# Altium schematic sheet BMC-01A.SchDoc
size A4
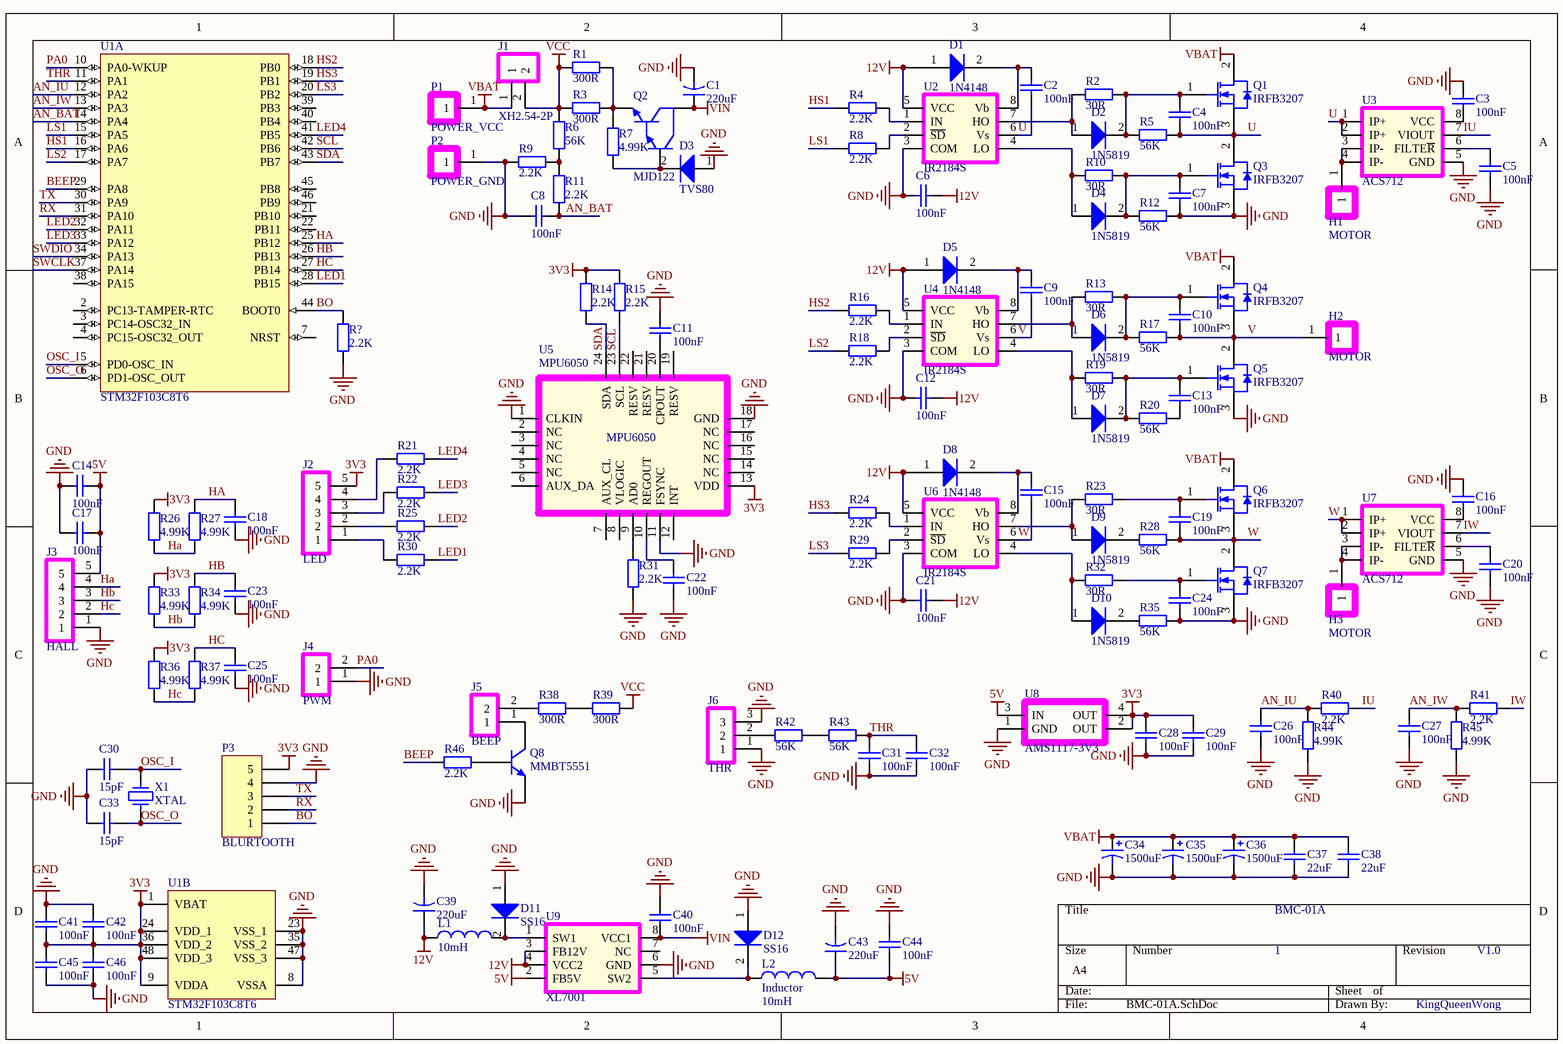
[diagram p0: BMC-01A.SchDoc]

## Parts
C1  value 220uF  [CAPR5-4X5]  (hidden comment: Cap2)
C2  value 100nF  [0603C]  (hidden comment: Cap)
C3  value 100nF  [0603C]  (hidden comment: Cap)
C4  value 100nF  [0603C]  (hidden comment: Cap)
C5  value 100nF  [0603C]  (hidden comment: Cap)
C6  value 100nF  [0603C]  (hidden comment: Cap)
C7  value 100nF  [0603C]  (hidden comment: Cap)
C8  value 100nF  [0603C]  (hidden comment: Cap)
C9  value 100nF  [0603C]  (hidden comment: Cap)
C10  value 100nF  [0603C]  (hidden comment: Cap)
C11  value 100nF  [0603C]  (hidden comment: Cap)
C12  value 100nF  [0603C]  (hidden comment: Cap)
C13  value 100nF  [0603C]  (hidden comment: Cap)
C14  value 100nF  [0603C]  (hidden comment: Cap)
C15  value 100nF  [0603C]  (hidden comment: Cap)
C16  value 100nF  [0603C]  (hidden comment: Cap)
C17  value 100nF  [0603C]  (hidden comment: Cap)
C18  value 100nF  [0603C]  (hidden comment: Cap)
C19  value 100nF  [0603C]  (hidden comment: Cap)
C20  value 100nF  [0603C]  (hidden comment: Cap)
C21  value 100nF  [0603C]  (hidden comment: Cap)
C22  value 100nF  [0603C]  (hidden comment: Cap)
C23  value 100nF  [0603C]  (hidden comment: Cap)
C24  value 100nF  [0603C]  (hidden comment: Cap)
C25  value 100nF  [0603C]  (hidden comment: Cap)
C26  value 100nF  [0603C]  (hidden comment: Cap)
C27  value 100nF  [0603C]  (hidden comment: Cap)
C28  value 100nF  [0603C]  (hidden comment: Cap)
C29  value 100nF  [0603C]  (hidden comment: Cap)
C30  value 15pF  [0603C]  (hidden comment: Cap)
C31  value 100nF  [0603C]  (hidden comment: Cap)
C32  value 100nF  [0603C]  (hidden comment: Cap)
C33  value 15pF  [0603C]  (hidden comment: Cap)
C34  value 1500uF  [RB7.6-15]  (hidden comment: Cap Pol1)
C35  value 1500uF  [RB7.6-15]  (hidden comment: Cap Pol1)
C36  value 1500uF  [RB7.6-15]  (hidden comment: Cap Pol1)
C37  value 22uF  [C1206]  (hidden comment: Cap)
C38  value 22uF  [C1206]  (hidden comment: Cap)
C39  value 220uF  [CAPR5-4X5]  (hidden comment: Cap2)
C40  value 100nF  [0603C]  (hidden comment: Cap)
C41  value 100nF  [0603C]  (hidden comment: Cap)
C42  value 100nF  [0603C]  (hidden comment: Cap)
C43  value 220uF  [CAPR5-4X5]  (hidden comment: Cap2)
C44  value 100nF  [0603C]  (hidden comment: Cap)
C45  value 100nF  [0603C]  (hidden comment: Cap)
C46  value 100nF  [0603C]  (hidden comment: Cap)
D1  1N4148  [SOD80C]
D2  1N5819  [SOD323]
D3  TVS80  [SMA]
D4  1N5819  [SOD323]
D5  1N4148  [SOD80C]
D6  1N5819  [SOD323]
D7  1N5819  [SOD323]
D8  1N4148  [SOD80C]
D9  1N5819  [SOD323]
D10  1N5819  [SOD323]
D11  SS16  [SMA]
D12  SS16  [SMA]
H1  MOTOR  [MOTOR]
H2  MOTOR  [MOTOR]
H3  MOTOR  [MOTOR]
J1  XH2.54-2P
J2  LED
J3  HALL
J4  PWM
J5  BEEP
J6  THR
L1  value 10mH  [CD43]  (hidden comment: Inductor)
L2  Inductor  value 10mH  [CD43]
P1  POWER_VCC  [POWER]
P2  POWER_GND  [POWER]
P3  BLURTOOTH  [HDR1X5]
Q1  IRFB3207  [TO220-3]
Q2  MJD122  [DPAK]
Q3  IRFB3207  [TO220-3]
Q4  IRFB3207  [TO220-3]
Q5  IRFB3207  [TO220-3]
Q6  IRFB3207  [TO220-3]
Q7  IRFB3207  [TO220-3]
Q8  MMBT5551  [SOT23]
R1  value 300R  [0603R]  (hidden comment: Res2)
R2  value 30R  [0603R]  (hidden comment: Res2)
R3  value 300R  [0603R]  (hidden comment: Res2)
R4  value 2.2K  [0603R]  (hidden comment: Res2)
R5  value 56K  [0603R]  (hidden comment: Res2)
R6  value 56K  [0603R]  (hidden comment: Res2)
R7  value 4.99K  [0603R]  (hidden comment: Res2)
R8  value 2.2K  [0603R]  (hidden comment: Res2)
R9  value 2.2K  [0603R]  (hidden comment: Res2)
R10  value 30R  [0603R]  (hidden comment: Res2)
R11  value 2.2K  [0603R]  (hidden comment: Res2)
R12  value 56K  [0603R]  (hidden comment: Res2)
R13  value 30R  [0603R]  (hidden comment: Res2)
R14  value 2.2K  [0603R]  (hidden comment: Res2)
R15  value 2.2K  [0603R]  (hidden comment: Res2)
R16  value 2.2K  [0603R]  (hidden comment: Res2)
R17  value 56K  [0603R]  (hidden comment: Res2)
R18  value 2.2K  [0603R]  (hidden comment: Res2)
R19  value 30R  [0603R]  (hidden comment: Res2)
R20  value 56K  [0603R]  (hidden comment: Res2)
R21  value 2.2K  [0603R]  (hidden comment: Res2)
R22  value 2.2K  [0603R]  (hidden comment: Res2)
R23  value 30R  [0603R]  (hidden comment: Res2)
R24  value 2.2K  [0603R]  (hidden comment: Res2)
R25  value 2.2K  [0603R]  (hidden comment: Res2)
R26  value 4.99K  [0603R]  (hidden comment: Res2)
R27  value 4.99K  [0603R]  (hidden comment: Res2)
R28  value 56K  [0603R]  (hidden comment: Res2)
R29  value 2.2K  [0603R]  (hidden comment: Res2)
R30  value 2.2K  [0603R]  (hidden comment: Res2)
R31  value 2.2K  [0603R]  (hidden comment: Res2)
R32  value 30R  [0603R]  (hidden comment: Res2)
R33  value 4.99K  [0603R]  (hidden comment: Res2)
R34  value 4.99K  [0603R]  (hidden comment: Res2)
R35  value 56K  [0603R]  (hidden comment: Res2)
R36  value 4.99K  [0603R]  (hidden comment: Res2)
R37  value 4.99K  [0603R]  (hidden comment: Res2)
R38  value 300R  [0603R]  (hidden comment: Res2)
R39  value 300R  [0603R]  (hidden comment: Res2)
R40  value 2.2K  [0603R]  (hidden comment: Res2)
R41  value 2.2K  [0603R]  (hidden comment: Res2)
R42  value 56K  [0603R]  (hidden comment: Res2)
R43  value 56K  [0603R]  (hidden comment: Res2)
R44  value 4.99K  [0603R]  (hidden comment: Res2)
R45  value 4.99K  [0603R]  (hidden comment: Res2)
R46  value 2.2K  [0603R]  (hidden comment: Res2)
R?  value 2.2K  [0603R]  (hidden comment: Res2)
U1  STM32F103C8T6  [STM-LQFP48_N]  (parts A,B of 2)
U2  IR2184S  [SOP8L]
U3  ACS712  [SOP8L]
U4  IR2184S  [SOP8L]
U5  MPU6050  [QFN24]
U6  IR2184S  [SOP8L]
U7  ACS712  [SOP8L]
U8  AMS1117-3V3  [SOT223]
U9  XL7001  [SOP8L]
X1  XTAL  [XTAL]

## Nets
3V3: C28.2 C29.2 C41.1 C42.1 C45.2 C46.2 J2.5 P3.5 R14.1 R15.1 R26.1 R33.1 R36.1 U1.1(VBAT) U1.9(VDDA) U1.24(VDD_1) U1.36(VDD_2) U1.48(VDD_3) U5.13(VDD) U8.2(OUT) U8.4(OUT)
5V: C14.2 C17.2 C43.1 C44.1 J3.5 L2.2 U8.3(IN) U9.2(FB5V)
12V: C6.2 C12.2 C21.2 C39.1 D1.1 D5.1 D8.1 L1.1 U2.5(VCC) U4.5(VCC) U6.5(VCC) U9.3(FB12V) U9.4(VCC2)
GND: C1.2 C3.1 C5.2 C6.1 C7.2 C8.2 C11.2 C12.1 C14.1 C16.1 C17.1 C18.1 C20.2 C21.1 C22.1 C23.1 C24.2 C25.1 C26.1 C27.1 C28.1 C29.1 C30.1 C31.1 C32.1 C33.2 C34.2 C35.2 C36.2 C37.1 C38.1 C39.2 C40.2 C41.2 C42.2 C43.2 C44.2 C45.1 C46.1 D3.1 D11.1 D12.1 J3.1 J4.1 J6.1 J6.3 P2.1 P3.4 Q3.3(SOURCE) Q5.3(SOURCE) Q7.3(SOURCE) Q8.3(E) R9.1 R12.1 R31.2 R35.1 R44.2 R45.2 R?.1 U1.8(VSSA) U1.23(VSS_1) U1.35(VSS_2) U1.47(VSS_3) U2.3(COM) U3.5(GND) U4.3(COM) U5.1(CLKIN) U5.11(FSYNC) U5.18(GND) U6.3(COM) U7.5(GND) U8.1(GND) U9.6(GND)
VBAT: C34.1 C35.1 C36.1 C37.2 C38.2 J1.1 P1.1 Q1.2(DRAIN) Q4.2(DRAIN) Q6.2(DRAIN)
VCC: J1.2 R1.1 R3.1 R6.1 R39.2
VIN: C1.1 C40.1 Q2.2 U9.8(VCC1)
AN_BAT: C8.1 R11.1 U1.14(PA4)
AN_IU: C26.2 R40.2 R44.1 U1.12(PA2)
AN_IW: C27.2 R41.2 R45.1 U1.13(PA3)
BEEP: R46.1 U1.29(PA8)
BO: P3.1 R?.2 U1.44(BOOT0)
HA: C18.2 J3.4 R26.2 R27.1 R27.2 U1.25(PB12)
HB: C23.2 J3.3 R33.2 R34.1 R34.2 U1.26(PB13)
HC: C25.2 J3.2 R36.2 R37.1 R37.2 U1.27(PB14)
HS1: R4.2 U1.16(PA6)
HS2: R16.2 U1.18(PB0)
HS3: R24.2 U1.19(PB1)
IU: R40.1 U3.7(VIOUT)
IW: R41.1 U7.7(VIOUT)
LED1: R30.2 U1.28(PB15)
LED2: R25.2 U1.32(PA11)
LED3: R22.2 U1.33(PA12)
LED4: R21.2 U1.41(PB5)
LS1: R8.2 U1.15(PA5)
LS2: R18.2 U1.17(PA7)
LS3: R29.2 U1.20(PB2)
OSC_I: C30.2 U1.5(PD0-OSC_IN) X1.2
OSC_O: C33.1 U1.6(PD1-OSC_OUT) X1.1
PA0: J4.2 U1.10(PA0-WKUP)
RX: P3.2 U1.31(PA10)
SCL: R15.2 U1.42(PB6) U5.23(SCL)
SDA: R14.2 U1.43(PB7) U5.24(SDA)
SWCLK: U1.37(PA14)
SWDIO: U1.34(PA13)
THR: C31.2 C32.2 R43.2 U1.11(PA1)
TX: P3.3 U1.30(PA9)
U: C2.2 C4.2 Q1.3(SOURCE) Q3.2(DRAIN) R5.1 U2.6(Vs) U3.1(IP+) U3.2(IP+)
V: C9.2 C10.2 H2.1 Q4.3(SOURCE) Q5.2(DRAIN) R17.1 U4.6(Vs)
W: C15.2 C19.2 Q6.3(SOURCE) Q7.2(DRAIN) R28.1 U6.6(Vs) U7.1(IP+) U7.2(IP+)
NetC2_1: C2.1 D1.2 U2.8(Vb)
NetC3_2: C3.2 U3.8(VCC)
NetC4_1: C4.1 D2.2 Q1.1(GATE) R2.1 R5.2
NetC5_1: C5.1 U3.6(FILTE~{R})
NetC7_1: C7.1 D4.2 Q3.1(GATE) R10.1 R12.2
NetC9_1: C9.1 D5.2 U4.8(Vb)
NetC10_1: C10.1 D6.2 Q4.1(GATE) R13.1 R17.2
NetC11_1: C11.1 U5.20(CPOUT)
NetC13_1: C13.1 D7.2 Q5.1(GATE) R19.1 R20.2
NetC13_2: C13.2 R20.1
NetC15_1: C15.1 D8.2 U6.8(Vb)
NetC16_2: C16.2 U7.8(VCC)
NetC19_1: C19.1 Q6.1(GATE) R23.1
NetC20_1: C20.1 U7.6(FILTE~{R})
NetC22_2: C22.2 U5.10(REGOUT)
NetC24_1: C24.1 Q7.1(GATE) R32.1
NetD2_1: D2.1 R2.2 U2.7(HO)
NetD3_2: D3.2 Q2.1 R7.2
NetD4_1: D4.1 R10.2 U2.4(LO)
NetD6_1: D6.1 R13.2 U4.7(HO)
NetD7_1: D7.1 R19.2 U4.4(LO)
NetD9_1: D9.1 R23.2 U6.7(HO)
NetD9_2: D9.2 R28.2
NetD10_1: D10.1 R32.2 U6.4(LO)
NetD10_2: D10.2 R35.2
NetD11_2: D11.2 L1.2 U9.1(SW1)
NetD12_2: D12.2 L2.1 U9.5(SW2)
NetH1_1: H1.1 U3.3(IP-) U3.4(IP-)
NetH3_1: H3.1 U7.3(IP-) U7.4(IP-)
NetJ2_1: J2.1 R30.1
NetJ2_2: J2.2 R25.1
NetJ2_3: J2.3 R22.1
NetJ2_4: J2.4 R21.1
NetJ5_1: J5.1 Q8.1(C)
NetJ5_2: J5.2 R38.1
NetJ6_2: J6.2 R42.1
NetQ2_3: Q2.3 R1.2 R3.2 R7.1
NetQ8_2: Q8.2(B) R46.2
NetR4_1: R4.1 U2.1(IN)
NetR6_2: R6.2 R9.2 R11.2
NetR8_1: R8.1 U2.2(~{SD})
NetR16_1: R16.1 U4.1(IN)
NetR18_1: R18.1 U4.2(~{SD})
NetR24_1: R24.1 U6.1(IN)
NetR29_1: R29.1 U6.2(~{SD})
NetR31_1: R31.1 U5.9(AD0)
NetR38_2: R38.2 R39.1
NetR42_2: R42.2 R43.1

Not connected (* = marked no-connect by the designer): U1 2(PC13-TAMPER-RTC) 3(PC14-OSC32_IN) 4(PC15-OSC32_OUT) 7(NRST) 21(PB10) 22(PB11) 38(PA15) 39(PB3) 40(PB4) 45(PB8) 46(PB9); U5 2(NC) 3(NC) 4(NC) 5(NC) 6(AUX_DA) 7(AUX_CL) 8(VLOGIC) 12(INT) 14(NC) 15(NC) 16(NC) 17(NC) 19(RESV) 21(RESV) 22(RESV); U9 7(NC)

## Notes on the sheet
- BMC-01A
- 1
- V1.0
- KingQueenWong

## Library data of the parts
C1 C39 C43 = Cap2: Capacitor; Published: 23-Sep-2002; PackageReference: CAPR5-4X5; Publisher: Altium Limited; PackageDescription: Capacitor; 2 Leads
C2-C33 C37 C38 C40-C42 C44-C46 = Cap: Capacitor; Published: 8-Jun-2000; LatestRevisionDate: 17-Jul-2002; LatestRevisionNote: Re-released for DXP Platform.; PackageReference: RAD-0.3; Publisher: Altium Limited; PackageDescription: Radial Cap, Thru-Hole; 2 Leads; 0.3 in Pin Spacing
C34-C36 = Cap Pol1: Polarized Capacitor (Radial); Published: 8-Jun-2000; LatestRevisionDate: 17-Jul-2002; LatestRevisionNote: Re-released for DXP Platform.; PackageReference: RB7.6-15; Publisher: Altium Limited; PackageDescription: Polarized Capacitor (Radial); 2 Leads
J2 J3 = XH2.54-5P
J4 J5 = XH2.54-2P
J6 = XH2.54-3P
L1 L2 = Inductor: Code_IEC: 1005; Published: 8-Jun-2000; LatestRevisionDate: 29-May-2009; LatestRevisionNote: IPC-7351 Footprint Added.; PackageReference: 0402-A; Publisher: Altium Limited; PackageDescription: Chip Inductor; Code_JEITA: 0402
P3 = Header 5: Header, 5-Pin; LatestRevisionDate: 17-Jul-2002; LatestRevisionNote: Re-released for DXP Platform.; Publisher: Altium Limited
Q2 = MJD122: NPN Darlington Transistor; Published: 8-Jun-2000; LatestRevisionDate: 17-Jan-2003; LatestRevisionNote: PCB Footprint replaced; DatasheetVersion: 1997; PackageVersion: Sep-1998; PackageReference: TO-92A; Publisher: Altium Limited; PackageDescription: TO, Flat Index; 3 In-Line, Axial Leads; Body Dia. 4.5mm; Leads 0.51 x 0.48 mm (max); ComponentLink1Description: Manufacturer Link; ComponentLink1URL: http://www.fairchildsemi.com/; ComponentLink2Description: Datasheet; ComponentLink2URL: http://www.fairchildsemi.com/ds/MP/MPSA14.pdf
Q8 = NPN: NPN Bipolar Transistor; Published: 8-Jun-2000; LatestRevisionDate: 17-Jul-2002; LatestRevisionNote: Re-released for DXP Platform.; PackageReference: TO-226-AA; Publisher: Altium Limited; PackageDescription: TO, Flat Index; 3 In-Line, Axial Leads; Body Dia. 4.8mm; Leads 0.55 x 0.51 mm (max); Code_JEDEC: TO-226-AA
R1-R46 R? = Res2: Resistor; Published: 8-Jun-2000; LatestRevisionDate: 17-Jul-2002; LatestRevisionNote: Re-released for DXP Platform.; PackageReference: AXIAL-0.4; Publisher: Altium Limited; PackageDescription: Axial Device, Thru-Hole; 2 Leads; 0.4 in Pin Spacing
U1 = STM32F103C8T6: ARM Cortex-M3 32-bit MCU, 64 KB Flash, 20 KB Internal RAM, 37 I/Os, 48-pin LQFP, -40 to 85 degC, Tray; A/D Converter: 2x12-bit (10 Channel); FLASH Size (Prog) (kB): 64; I/Os (High Current): 37; Internal RAM Size (kB): 20; Operating Frequency(F) (Processor speed) (MHz): 72; Supply Voltage(Vcc) min (V): 2; DatasheetVersion: Rev. 16; PackageVersion: Rev. 6, 06/2013; PackageReference: LQFP48; PackageDescription: 48-Pin Low Profile Quad Flat Package, 7 x 7 mm Body, 0.5 mm Pitch; Supplier 1: Digi-Key; Supplier Part Number 1: 497-6063-ND; Supplier 2: Farnell; Supplier Part Number 2: 1447637; Supplier 3: Newark; Supplier Part Number 3: 59M2182; Supplier 4: Newark; Supplier Part Number 4: 57P1222; Supplier 5: Mouser; Supplier Part Number 5: 511-STM32F103C8T6; Core: ARM Cortex-M3; Packing: Tray; Mounting Technology: Surface Mount; PartNumber: STM32F103C8T6; ComponentLink1Description: Manufacturer URL; ComponentLink1URL: http://www.st.com/web/en/home.html; ComponentLink2Description: Datasheet; ComponentLink2URL: http://www.st.com/st-web-ui/static/active/en/resource/technical/document/datasheet/CD00161566.pdf; ComponentLink3Description: Package Specification; ComponentLink3URL: http://www.st.com/st-web-ui/static/active/en/resource/technical/document/datasheet/DM00058181.pdf
U3 U7 = ACS712: ACS712ELCTR-05B-T